# Altium schematic sheet 5V_Buck.SchDoc: 5V_BUCK
size 431 x 279 mm; Author: Shivam Sharma; SheetNumber: 8; SheetTotal: 14; SheetRevision: 1.0
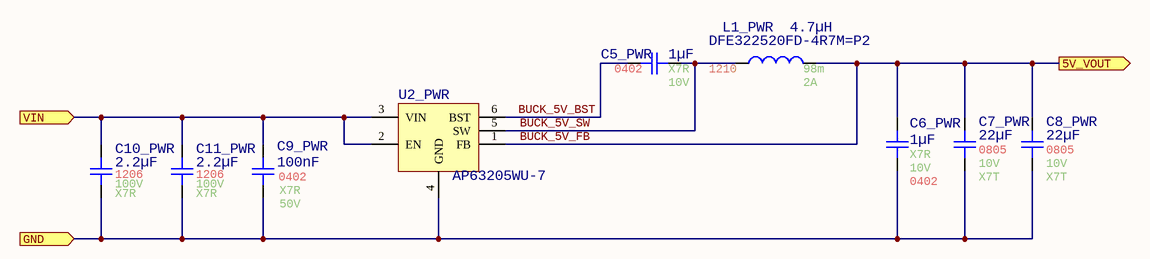
[diagram p0: 5V_Buck.SchDoc]

## Parts
C5_PWR  value 1µF  Temperature Coefficient: X7R  Voltage Rating: 10V  Case/Package: 0402  [Generic 0402 capacitor]  (hidden comment: MAASL105CD7105MFCA01)
C6_PWR  value 1µF  Temperature Coefficient: X7R  Voltage Rating: 10V  Case/Package: 0402  [Generic 0402 capacitor]  (hidden comment: MAASL105CD7105MFCA01)
C7_PWR  value 22µF  Temperature Coefficient: X7T  Voltage Rating: 10V  Case/Package: 0805  [Generic 0805 Cap]  (hidden comment: GRT21BD71A226ME13L)
C8_PWR  value 22µF  Temperature Coefficient: X7T  Voltage Rating: 10V  Case/Package: 0805  [Generic 0805 Cap]  (hidden comment: GRT21BD71A226ME13L)
C9_PWR  value 100nF  Temperature Coefficient: X7R  Voltage Rating: 50V  Case/Package: 0402  [Generic 0402 capacitor]  (hidden comment: GRT155R71H104KE01D)
C10_PWR  value 2.2µF  Temperature Coefficient: X7R  Voltage Rating: 100V  Case/Package: 1206  [Generic 1206 Capacitor]  (hidden comment: 12061C225K4T2A)
C11_PWR  value 2.2µF  Temperature Coefficient: X7R  Voltage Rating: 100V  Case/Package: 1206  [Generic 1206 Capacitor]  (hidden comment: 12061C225K4T2A)
L1_PWR  DFE322520FD-4R7M=P2  value 4.7µH  DCR: 98m  Current Rating: 2A  Case/Package: 1210  [FP-DFE322520F_D-IPC_A]
U2_PWR  AP63205WU-7  [TSOT-26-6 - 3.2mm]

## Ports
5V_VOUT (out), GND (in), VIN (in)

## Nets
BUCK_5V_BST: C5_PWR.2 U2_PWR.6(BST)
BUCK_5V_FB: C6_PWR.2 C7_PWR.2 C8_PWR.2 L1_PWR.2 U2_PWR.1(FB) ; port 5V_VOUT
BUCK_5V_SW: C5_PWR.1 L1_PWR.1 U2_PWR.5(SW)
GND: C6_PWR.1 C7_PWR.1 C8_PWR.1 C9_PWR.2 C10_PWR.1 C11_PWR.1 U2_PWR.4(GND) ; port GND
VIN: C9_PWR.1 C10_PWR.2 C11_PWR.2 U2_PWR.2(EN) U2_PWR.3(VIN) ; port VIN

## Notes on the sheet
- Title:
- Author:
- Approved:
- Size:
- Date:
- Git Hash:
- Sch Revision:
- B
- Prj:
- Sheet Revision:
- Variant:
- Edited:
- CONFIDENTIAL
- File:

## Library data of the parts
C5_PWR C6_PWR = CMP-001-00104-2: Cap Cer 1UF 20V X7T 0402; AECQ: Yes; Capacitor Type: Ceramic; Tolerance: 20%; Min Operating Temperature: -55°C; Max Operating Temperature: 125°C; Pins: 2; RoHS Compliant: Yes; Mounting Technology: Surface Mount
C7_PWR C8_PWR = CMP-001-00095-2: 22 µF ±20% 10V Ceramic Capacitor X7T 0805 (2012 Metric); AECQ: Yes; Mounting Technology: SMD; Tolerance: 20%; Capacitor Type: Ceramic; Min Operating Temperature: -55°C; Pins: 2; Max Operating Temperature: 125°C
C9_PWR = CMP-001-00084-12: Ceramic Capacitor, Multilayer, Ceramic, 50V, 10% +Tol, 10% -Tol, X7R, 15% TC, 0.1uF, Surface Mount, 0402; AECQ: Yes; Reach SVHC Compliant: Yes; Mounting Technology: Surface Mount; Termination: Wraparound; Pins: 2; Packaging: Tape and Reel; Package Shape: Rectangular; Multilayer: Yes; Tolerance: 10%; Max Operating Temperature: 125°C; Terminal Finish: Nickel; Capacitor Type: Ceramic; Dielectric Material: Ceramic; Min Operating Temperature: -55°C; RoHS Compliant: Yes
C10_PWR C11_PWR = CMP-001-00086-3: Ceramic Capacitor, Multilayer, Ceramic, 100V, 10% +Tol, 10% -Tol, X7R, 15% TC, 2.2uF, Surface Mount, 1206; AECQ: Yes; RoHS Compliant: Yes; Mounting Technology: SMD; Min Operating Temperature: 125°C; Max Operating Temperature: -55°C; Capacitor Type: Ceramic; Tolerance: 10%; Pins: 2
L1_PWR = CMP-006-00022-5: General Purpose Inductor, 4.7uH, 20%, 1 Element, Metal Alloy-Core, SMD, 1210; AECQ: Yes; ComponentLink2Description: https://www.bourns.com/docs/Product-Datasheets/SRP4021HMCT.pdf; Min Operating Temperature: -40°C; Tolerance: 20%; Max Operating Temperature: 125°C; Pins: 2
U2_PWR = AP63205WU-7: 5V fixed step down Buck